# Altium schematic sheet Vsense Thermistor.SchDoc: Temperature Sensor (Thermistor)
size Letter; Date: 2017-07-12; DocumentNumber: 14; Revision: B; SheetNumber: 14; SheetTotal: 16; DesignedBy: Mike MacKay
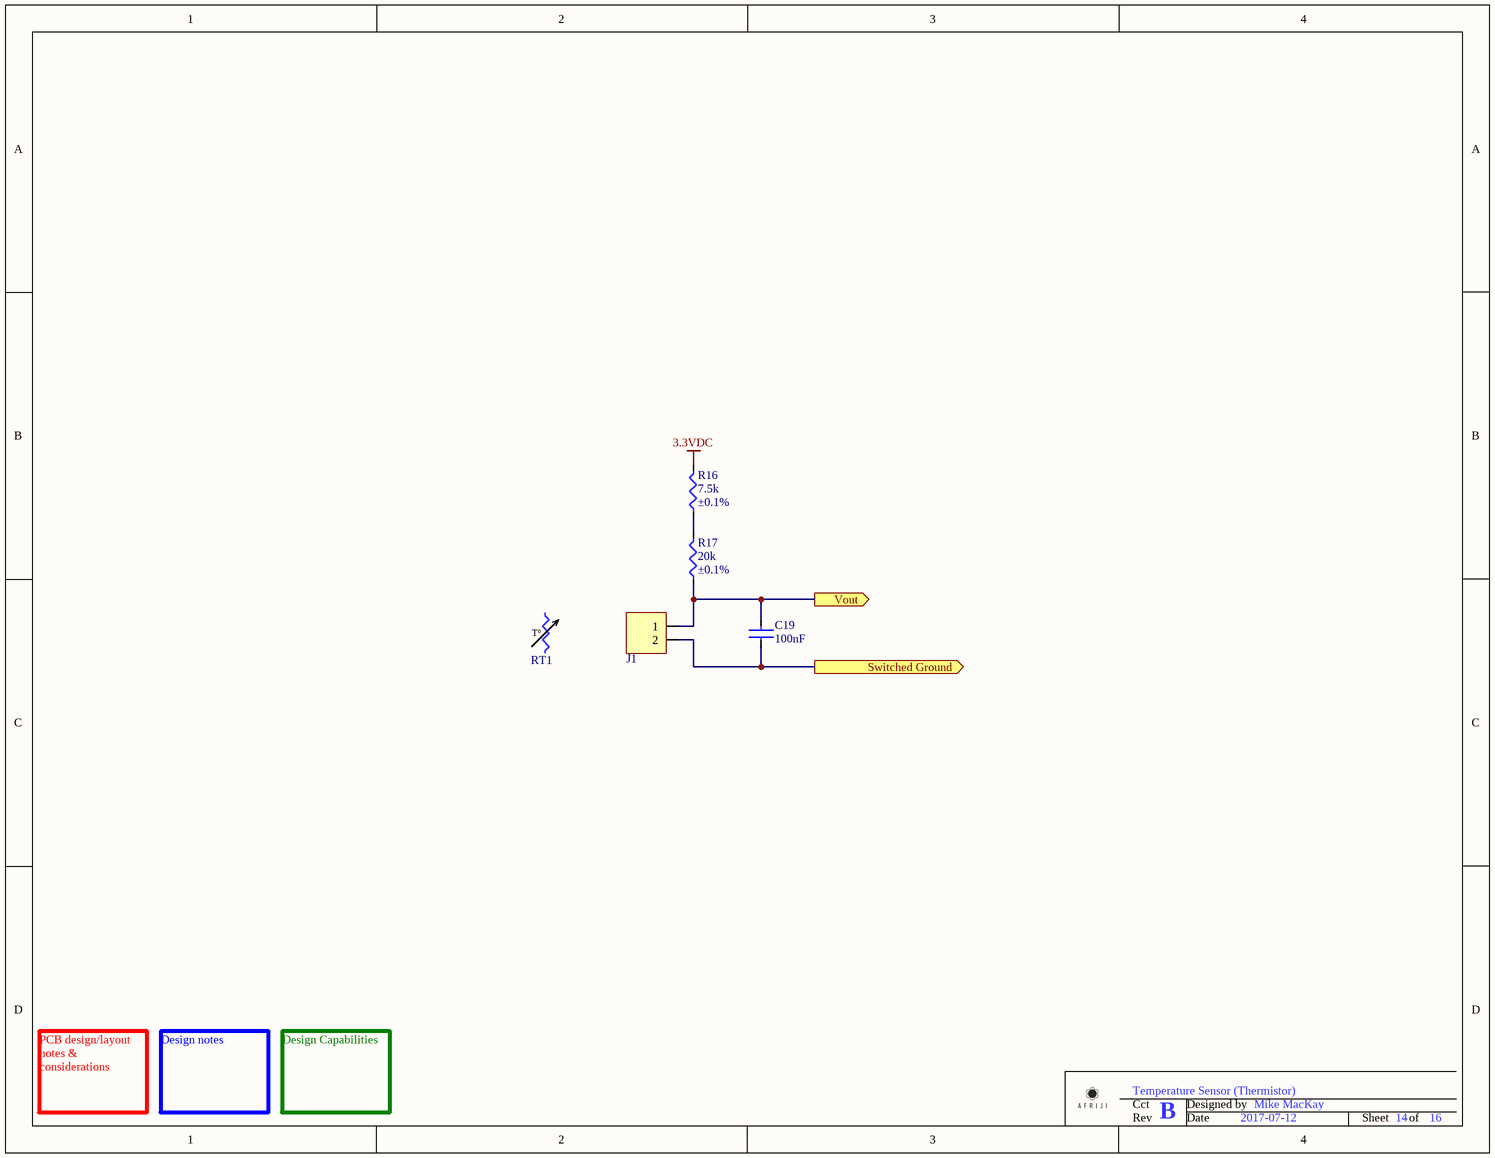
[diagram p0: Vsense Thermistor.SchDoc]

## Parts
C19  Capacitance: 100nF  [C0603 - Ceramic]  (hidden comment: 100nF 0603 50V)
J1  Tº  (value not drawn)
R16  Resistance (Ohms): 7.5k  Tolerance: ±0.1%  [R0603]  (hidden comment: 7.5k 0603 0.1%)
R17  Resistance (Ohms): 20k  Tolerance: ±0.1%  [R0603]  (hidden comment: 20k 0603 0.1%)
RT1  Tº  [Connector - MTA-100 2 Position Friction Lock]  (value not drawn)  (mechanical)

## Ports
Switched Ground (out), Vout (out)

## Nets
3.3VDC: R16.1
Switched Ground: C19.2 J1.2 ; port Switched Ground
Vout: C19.1 J1.1 R17.2 ; port Vout
NetR16_2: R16.2 R17.1

## Notes on the sheet
- PCB design/layout notes & considerations
- Design notes
- Design Capabilities
- Cct
- Designed by
- Rev
- Date
- Sheet
- of

## Library data of the parts
C19 = 100nF 0603 50V: Manufacturer: Samsung Electro-Mechanics America, Inc; Manufacturer Part Number: CL10B104KB8SFNC; Tolerance: ±10%; Temperature Coefficient: X7R; Value: 100nF 0603 50V; Supplier 1: Digi-Key; RoHS: RoHS Compliant; Category: Capacitors; Stock 1: 1192070; Pricing 1: 1=0.1, 10=0.027, 25=0.0192, 100=0.0125, 500=0.00874, 1000=0.00681 (USD); Packaging: Cut Tape (CT); Voltage - Rated: 50V; Mounting Type: Surface Mount, MLCC; Operating Temperature: -55°C ~ 125°C; Applications: Boardflex Sensitive; Ratings: -; Package / Case: 0603 (1608 Metric); Size / Dimension: 0.063" L x 0.031" W (1.60mm x 0.80mm); Height - Seated (Max): -; Thickness (Max): 0.035" (0.90mm); Lead Spacing: -; Features: Soft Termination; Lead Style: -; ComponentLink1URL: http://www.samsungsem.com/kr/front/downloadcms.do?path=/kr/support/product-search/mlcc/__icsFiles/afieldfile/2014/11/05&fileName=S_CL10B104KB8SFNC.pdf; ComponentLink1Description: http://www.samsungsem.com/kr/front/downloadcms.do?path=/kr/support/product-search/mlcc/__icsFiles/afieldfile/2014/11/05&fileName=S_CL10B104KB8SFNC.pdf; Supplier Part Number 1: 1276-1936-1-ND
J1 = MTA100-2 with friction Lock: Manufacturer: TE Connectivity AMP Connectors; Manufacturer Part Number: 640456-2; Connector Type: Header; Pitch - Mating: 0.100" (2.54mm); Style: Board to Cable/Wire; Shrouding: Shrouded - 1 Wall; Number of Positions: 2; Number of Positions Loaded: All; Contact Length - Mating: 0.295" (7.49mm); Contact Length - Post: 0.140" (3.56mm); Overall Contact Length: 0.535" (13.59mm); Material Flammability Rating: UL94 V-0; Current Rating: Varies by Wire Gauge; Voltage Rating: 250VAC; Value: MTA100-2 with friction Lock; Supplier 1: Digi-Key; Supplier Part Number 1: A1921-ND; RoHS: RoHS Compliant; Category: Connectors, Interconnects; Stock 1: 177276; Pricing 1: 1=0.12, 10=0.117, 50=0.0748, 100=0.0724, 250=0.0624, 500=0.05992, 1000=0.05243, 2500=0.04744 (USD); Packaging: Bulk; Part Status: Active; Operating Temperature: -55°C ~ 105°C; Mounting Type: Through Hole; ComponentLink1URL: http://www.te.com/commerce/DocumentDelivery/DDEController?Action=srchrtrv&DocNm=640456&DocType=Customer+Drawing&DocLang=English; ComponentLink1Description: Spec Sheet; Contact Type: Male Pin; Number of Rows: 1; Row Spacing - Mating: -; Termination: Solder; Fastening Type: Friction Lock; Insulation Height: 0.305" (7.75mm); Contact Shape: Square; Contact Finish - Mating: Tin; Contact Finish Thickness - Mating: -; Contact Finish - Post: Tin; Contact Material: Copper Alloy; Insulation Material: Thermoplastic; Features: -; Ingress Protection: -; Insulation Color: Natural; Mated Stacking Heights: -; Contact Finish Thickness - Post: -; Applications: General Purpose
R16 = 7.5k 0603 0.1%: Resistor; Manufacturer: Yageo; Manufacturer Part Number: RT0603BRD077K5L; Power (Watts): 0.1W, 1/10W; Temperature Coefficient: ±25ppm/°C; Technology: SMT; Value: 7.5k 0603 0.1%; Supplier 1: Digi-Key; Supplier Part Number 1: YAG2311CT-ND; RoHS: RoHS Compliant; Category: Resistors; Stock 1: 15357; Pricing 1: 1=0.32, 10=0.269, 25=0.1952, 50=0.1416, 100=0.105, 250=0.0806, 500=0.0635, 1000=0.04396 (USD); Packaging: Cut Tape (CT); Part Status: Active; Composition: Thin Film; Features: Moisture Resistant; Operating Temperature: -55°C ~ 155°C; Package / Case: 0603 (1608 Metric); Supplier Device Package: 0603; Size / Dimension: 0.063" L x 0.031" W (1.60mm x 0.80mm); Height - Seated (Max): 0.022" (0.55mm); Number of Terminations: 2; Failure Rate: -; ComponentLink1URL: http://www.yageo.com/documents/recent/PYu-RT_1-to-0.05_RoHS_L_7.pdf; ComponentLink1Description: Spec Sheet
R17 = 20k 0603 0.1%: Resistor; Manufacturer: Yageo; Manufacturer Part Number: RT0603BRD0720KL; Power (Watts): 0.1W, 1/10W; Temperature Coefficient: ±25ppm/°C; Technology: SMT; Value: 20k 0603 0.1%; Supplier 1: Digi-Key; Supplier Part Number 1: YAG1582CT-ND; RoHS: RoHS Compliant; Category: Resistors; Stock 1: 24543; Pricing 1: 1=0.35, 10=0.297, 25=0.216, 50=0.1566, 100=0.1161, 250=0.08912, 500=0.0702, 1000=0.0486 (USD); Packaging: Cut Tape (CT); Part Status: Active; Composition: Thin Film; Features: Moisture Resistant; Operating Temperature: -55°C ~ 155°C; Package / Case: 0603 (1608 Metric); Supplier Device Package: 0603; Size / Dimension: 0.063" L x 0.031" W (1.60mm x 0.80mm); Height - Seated (Max): 0.022" (0.55mm); Number of Terminations: 2; Failure Rate: -; ComponentLink1URL: http://www.yageo.com/documents/recent/PYu-RT_1-to-0.05_RoHS_L_7.pdf; ComponentLink1Description: Spec Sheet
RT1 = Thermistor 10k Type J: Resistor; Manufacturer: Murata Electronics North America; Manufacturer Part Number: NXFT15XH103FA2B025; Resistance in Ohms @ 25°C: 10k; Resistance Tolerance: ±1%; B25/50: 3380K; B25/85: 3434K; B25/100: 3455K; Power - Max: 100mW; Value: Thermistor 10k; Supplier 1: Digi-Key; RoHS: RoHS Compliant; Category: Sensors, Transducers; Stock 1: 21226; Pricing 1: 1=0.91, 10=0.752, 25=0.6608, 50=0.549, 100=0.4676, 250=0.42692, 500=0.4066, 1000=0.35578, 2500=0.34053 (USD); Packaging: Bulk; Part Status: Active; Mounting Type: Free Hanging; Operating Temperature: -40°C ~ 125°C; ComponentLink1URL: http://www.murata.com/~/media/webrenewal/support/library/catalog/products/thermistor/ntc/r44e.ashx; ComponentLink1Description: Spec Sheet; Supplier Part Number 1: 490-5628-ND; Technology: THT; B Value Tolerance: ±1%; B0/50: -; B25/75: -; Length - Lead Wire: -; Package / Case: Bead